# EasyEDA Pro project spark-switch.epro, board switch
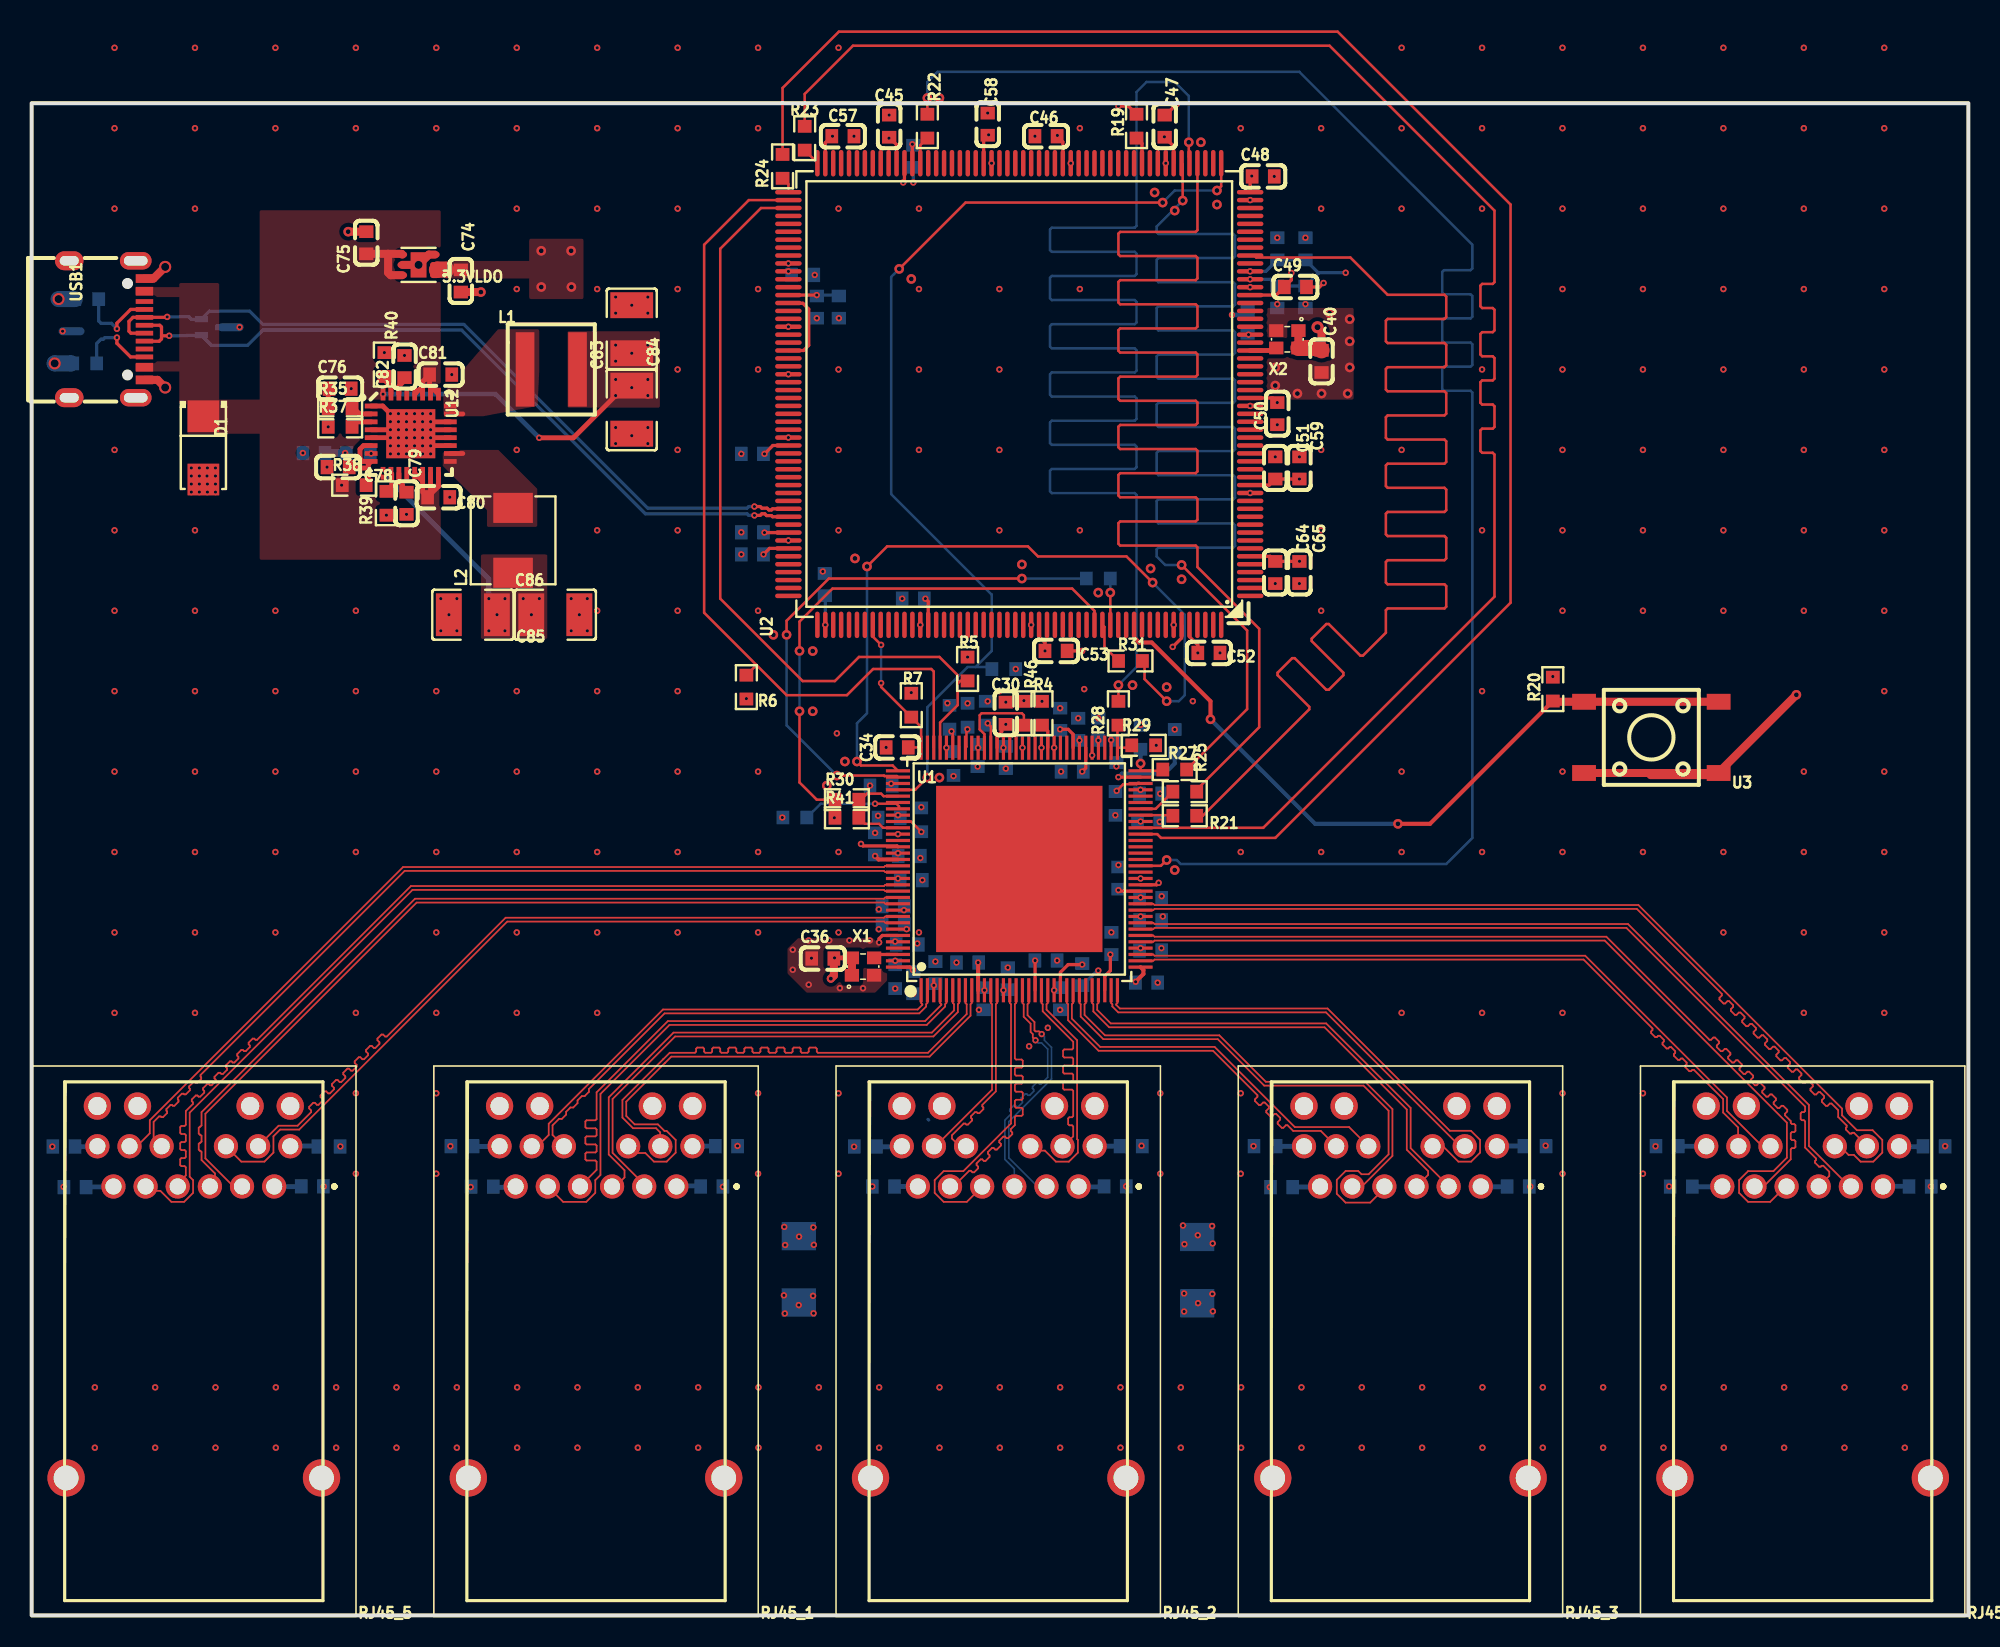
[diagram p5: board, top side]
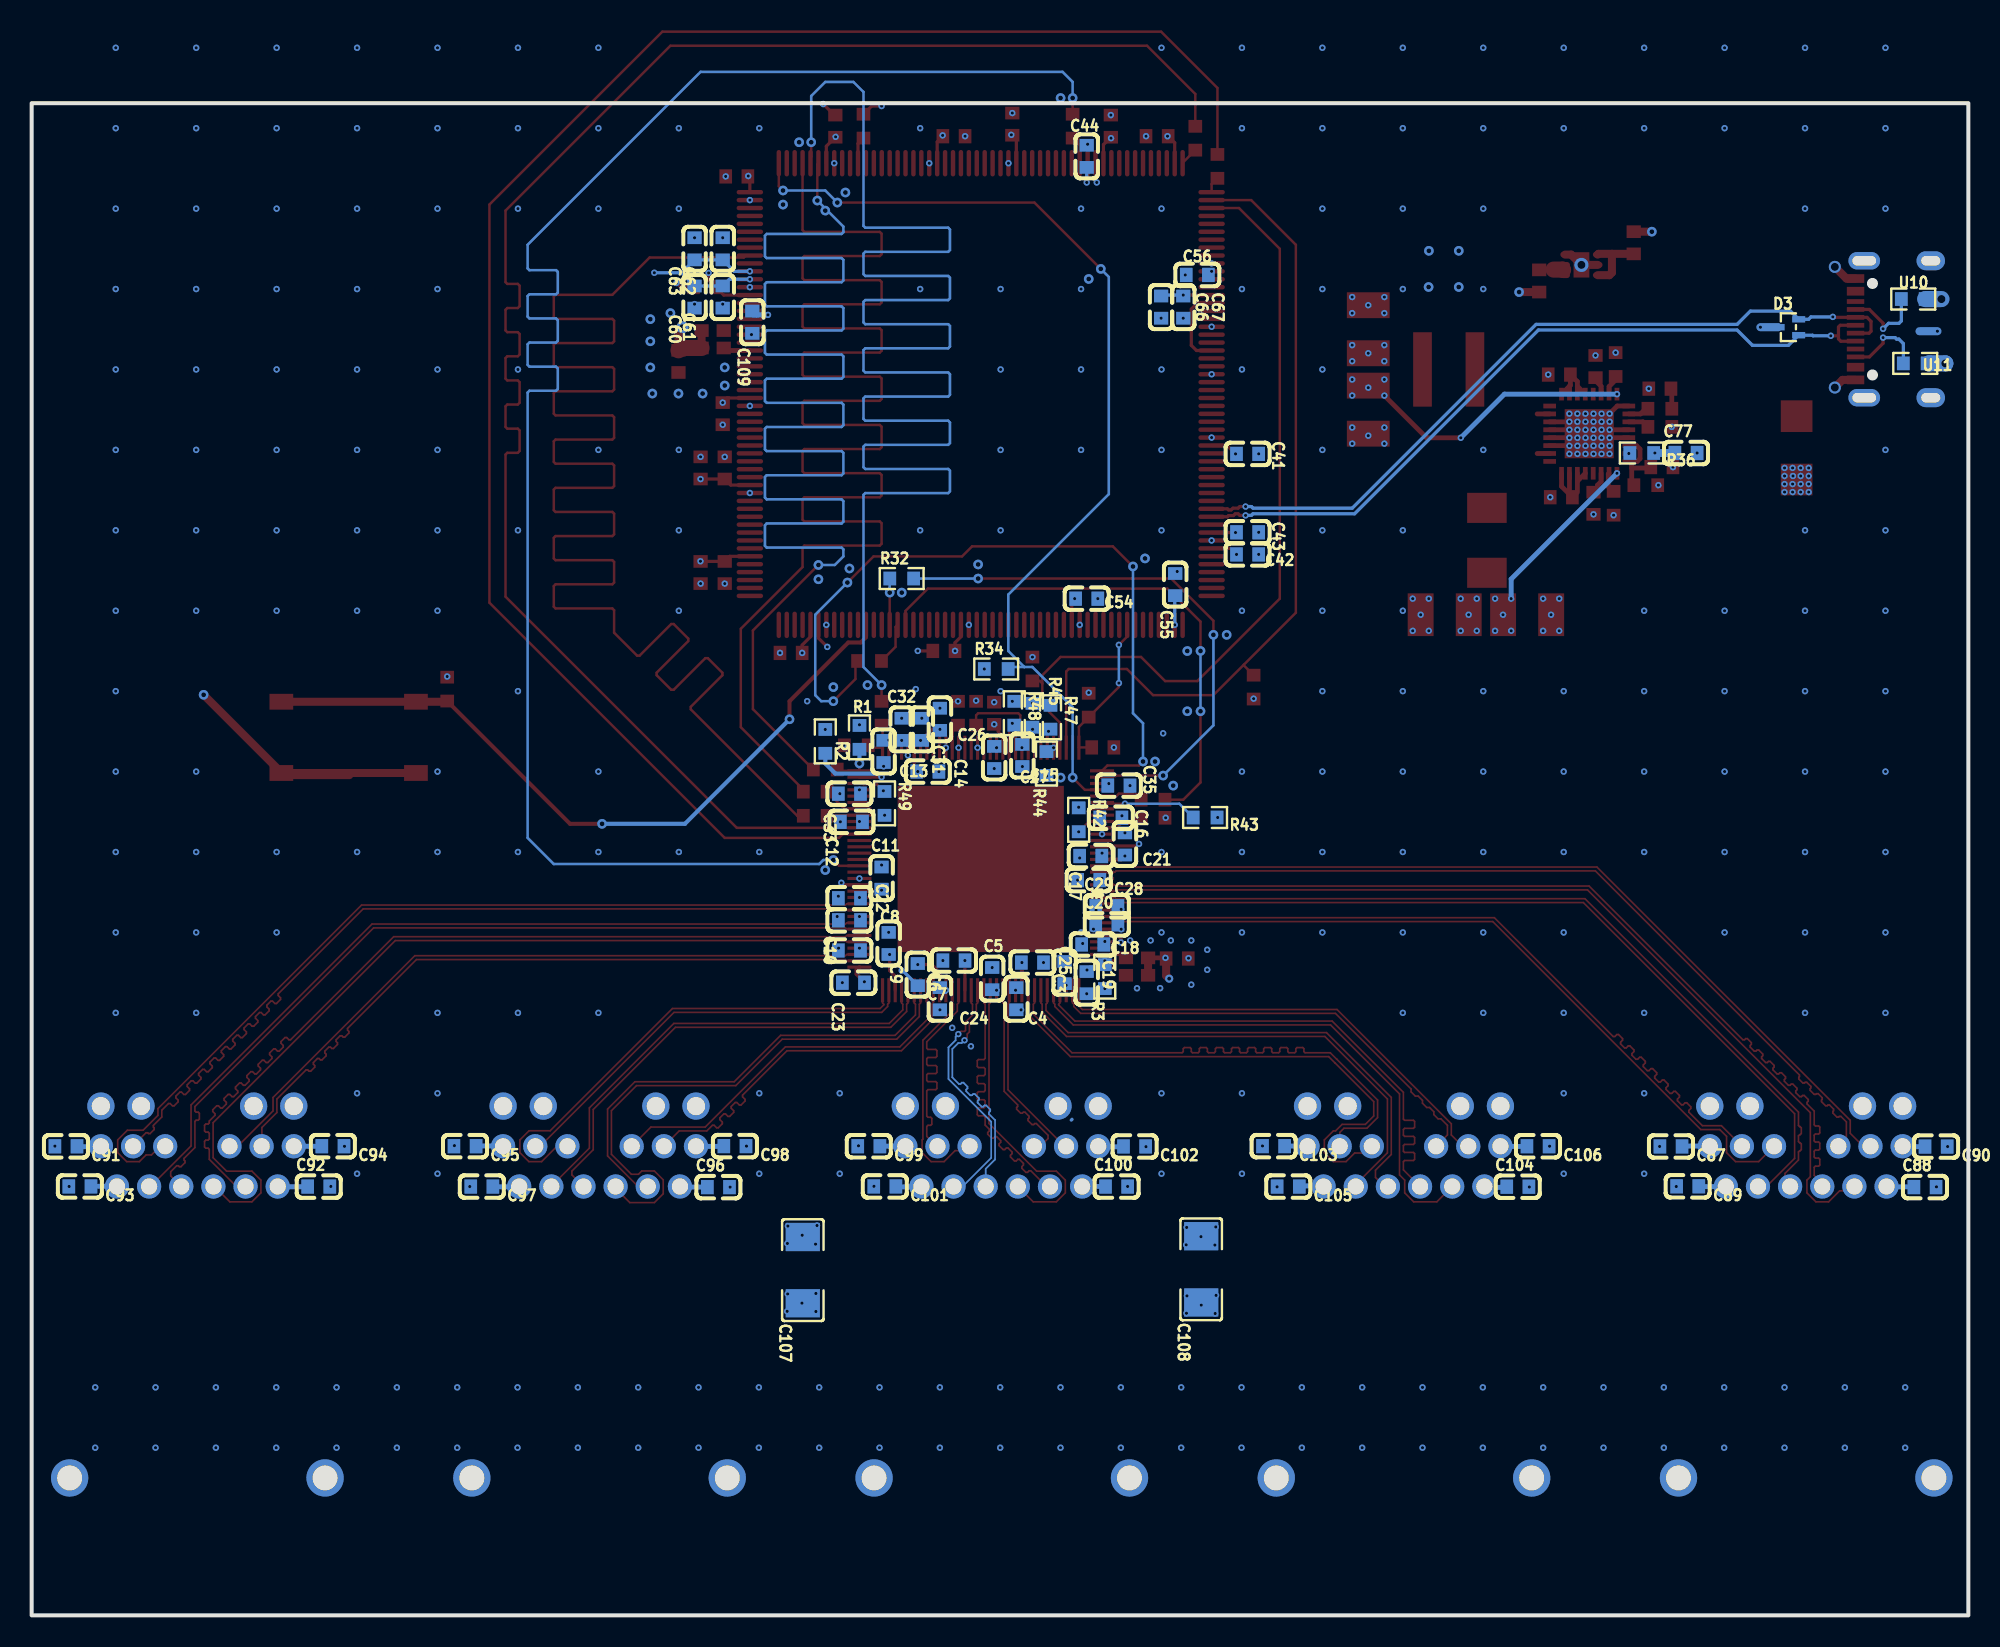
[diagram p6: board, bottom side, seen from below]

Outline 122.3 x 95.52 mm; copper layers: Top Layer, Inner1, Inner2, Inner3, Inner4, Bottom Layer. Coordinates in mm from the lower left corner of the outline.
Outline path: rectangle 0,95.52 122.3,0
Stack: Top Layer 0.035mm Outer layer thickness 1oz / Dielectric1 0.0994mm 3313 RC57% 4.2mil / Inner1 0.0152mm Inner layer thickness / Dielectric2 0.55mm 0.55mm H/H No copper / Inner2 0.0152mm Inner layer thickness / Dielectric3 0.1088mm 2116 RC54% 4.9mil / Inner3 0.0152mm Inner layer thickness / Dielectric4 0.55mm 0.55mm H/H No copper / Inner4 0.0152mm Inner layer thickness / Dielectric5 0.0994mm 3313 RC57% 4.2mil / Bottom Layer 0.035mm Outer layer thickness 1oz

## Design rules (mm)
net P2_1: Ethernet, A1
net P3_1: Ethernet, A1
net P4_1: Ethernet, B1
net P5_1: Ethernet, C1
net P6_1: Ethernet, C1
net P7_1: Ethernet, B1
net P8_1: Ethernet, D1
net P9_1: Ethernet, D1
net P2_2: Ethernet, A2
net P3_2: Ethernet, A2
net P4_2: Ethernet, B2
net P5_2: Ethernet, C2
net P6_2: Ethernet, C2
net P7_2: Ethernet, B2
net P8_2: Ethernet, D2
net P9_2: Ethernet, D2
net P2_3: Ethernet, A3
net P3_3: Ethernet, A3
net P4_3: Ethernet, B3
net P5_3: Ethernet, C3
net P6_3: Ethernet, C3
net P7_3: Ethernet, B3
net P8_3: Ethernet, D3
net P9_3: Ethernet, D3
net P2_4: Ethernet, A4
net P3_4: Ethernet, A4
net P4_4: Ethernet, B4
net P5_4: Ethernet, C4
net P6_4: Ethernet, C4
net P7_4: Ethernet, B4
net P8_4: Ethernet, D4
net P9_4: Ethernet, D4
net P2_5: Ethernet, A5
net P3_5: Ethernet, A5
net P4_5: Ethernet, B5
net P5_5: Ethernet, C5
net P6_5: Ethernet, C5
net P7_5: Ethernet, B5
net P8_5: Ethernet, D5
net P9_5: Ethernet, D5
net D+: DP2
net D-: DP2
net CC1: DP1
net CC2: DP1
template: Custom Config
spacing copperThickness1oz (default): track to track 0.102, other pairs 0.152 to 0.3
spacing copperThickness2oz: track to track 0.203, other pairs 0.152 to 0.3
spacing copperThicknessInner0.5oz: track to track 0.089, other pairs 0.152 to 0.3
spacing Ethernet: track to track 0.381, other pairs 0.152 to 0.305
spacing 50OhmSE: track to track 0.457, other pairs 0.152 to 0.3
spacing LED: track to track 0.762, other pairs 0.152 to 0.3
track width copperThickness1oz (default): min 0.102, default 0.305, max 2.54
track width copperThickness2oz: min 0.203, default 0.254, max 2.54
track width Ethernet: min 0.104, default 0.104, max 0.104
track width copperThickness0.5oz: min 0.089, default 0.254, max 2.54
track width 50OhmSE: min 0.157, default 0.157, max 0.157
track width LED: min 0.152, default 0.152, max 0.152
differential pair differentialPair (default): width min 0.127, default 0.254, max 2.54; gap min 0.152, default 0.152
differential pair Ethernet: width min 0.104, default 0.104, max 0.104; gap min 0.14, default 0.14
via viaSize (default): diameter min 0.3, default 0.406, max 10; hole min 0.2, default 0.203, max 6.3
via Ethernet: diameter min 0.4, default 0.4, max 0.4; hole min 0.2, default 0.2, max 0.2
net class Ethernet uses Ethernet
net GND uses copperRegion3
net 1.2V uses copperRegion3
net 3.3V uses copperRegion3
net P2_1 uses Ethernet
net P3_1 uses Ethernet
net P4_1 uses Ethernet
net P5_1 uses Ethernet
net P6_1 uses Ethernet
net P7_1 uses Ethernet
net P8_1 uses Ethernet
net P9_1 uses Ethernet
net P2_2 uses Ethernet
net P3_2 uses Ethernet
net P4_2 uses Ethernet
net P5_2 uses Ethernet
net P6_2 uses Ethernet
net P7_2 uses Ethernet
net P8_2 uses Ethernet
net P9_2 uses Ethernet
net P2_3 uses Ethernet
net P3_3 uses Ethernet
net P4_3 uses Ethernet
net P5_3 uses Ethernet
net P6_3 uses Ethernet
net P7_3 uses Ethernet
net P8_3 uses Ethernet
net P9_3 uses Ethernet
net P2_4 uses Ethernet
net P3_4 uses Ethernet
net P4_4 uses Ethernet
net P5_4 uses Ethernet
net P6_4 uses Ethernet
net P7_4 uses Ethernet
net P8_4 uses Ethernet
net P9_4 uses Ethernet
net P2_5 uses Ethernet
net P3_5 uses Ethernet
net P4_5 uses Ethernet
net P5_5 uses Ethernet
net P6_5 uses Ethernet
net P7_5 uses Ethernet
net P8_5 uses Ethernet
net P9_5 uses Ethernet
net 5V uses copperRegion2
net IND2.5 uses copperRegion2
net IND1.2 uses copperRegion2
diff pair A1 uses Ethernet
diff pair B1 uses Ethernet
diff pair C1 uses Ethernet
diff pair D1 uses Ethernet
diff pair A2 uses Ethernet
diff pair B2 uses Ethernet
diff pair C2 uses Ethernet
diff pair D2 uses Ethernet
diff pair A3 uses Ethernet
diff pair B3 uses Ethernet
diff pair C3 uses Ethernet
diff pair D3 uses Ethernet
diff pair A4 uses Ethernet
diff pair B4 uses Ethernet
diff pair C4 uses Ethernet
diff pair D4 uses Ethernet
diff pair A5 uses Ethernet
diff pair B5 uses Ethernet
diff pair C5 uses Ethernet
diff pair D5 uses Ethernet
pour e5324 uses copperRegion3

## Placement (name value [footprint] x y rotation side)
3.3VLDO  TLV76733DRVR  [WSON-6_L2.0-W2.0-P0.65-TL-EP]  24.43 85.3 180 top
C3  100nF  [C0603]  57.07 40.6 90 bottom
C4  100nF  [C0603]  60.12 38.95 270 bottom
C5  100nF  [C0603]  61.64 40.22 90 bottom
C6  100nF  [C0603]  64.06 41.36 0 bottom
C7  100nF  [C0603]  66.34 40.47 270 bottom
C8  100nF  [C0603]  68.18 42.44 90 bottom
C9  100nF  [C0603]  70.66 42 0 bottom
C10  100nF  [C0603]  70.66 43.9 0 bottom
C11  100nF  [C0603]  68.63 46.57 90 bottom
C12  100nF  [C0603]  70.53 50.12 0 bottom
C13  100nF  [C0603]  68.5 54.57 270 bottom
C14  100nF  [C0603]  65.71 53.3 180 bottom
C15  100nF  [C0603]  59.74 54.32 270 bottom
C16  100nF  [C0603]  54.15 50.38 180 bottom
C17  100nF  [C0603]  55.42 47.97 0 bottom
C18  100nF  [C0603]  55.29 42.38 0 bottom
C19  100nF  [C0603]  55.67 39.96 270 bottom
C20  100nF  [C0603]  54.4 43.65 180 bottom
C21  100nF  [C0603]  53.26 48.73 90 bottom
C22  100nF  [C0603]  70.66 45.3 0 bottom
C23  100nF  [C0603]  70.41 39.96 0 bottom
C24  100nF  [C0603]  64.95 38.95 270 bottom
C25  100nF  [C0603]  59.1 41.23 180 bottom
C26  100nF  [C0603]  64.95 56.6 90 bottom
C27  100nF  [C0603]  61.52 54.19 270 bottom
C28  100nF  [C0603]  55.55 46.44 0 bottom
C29  100nF  [C0603]  54.4 44.79 180 bottom
C30  100nF  [C0603]  61.52 56.98 90 top
C31  100nF  [C0603]  66.09 55.97 90 bottom
C32  100nF  [C0603]  67.36 55.97 90 bottom
C33  100nF  [C0603]  70.66 51.9 0 bottom
C34  10uF  [C0603]  54.66 54.82 180 top
C35  100nF  [C0603]  53.64 52.41 180 bottom
C36  10nF  [C0603]  49.96 41.49 0 top
C40  10nF  [C0603]  81.46 79.21 270 top
C41  100nF  [C0603]  45.51 73.37 180 bottom
C42  100nF  [C0603]  45.51 67.02 180 bottom
C43  2.2uF  [C0603]  45.51 68.41 180 bottom
C44  2.2uF  [C0603]  55.67 92.16 270 bottom
C45  100nF  [C0603]  54.15 94.07 90 top
C46  100nF  [C0603]  64.06 93.43 180 top
C47  100nF  [C0603]  71.55 94.07 90 top
C48  100nF  [C0603]  77.77 90.89 0 top
C49  100nF  [C0603]  79.8 83.91 0 top
C50  100nF  [C0603]  78.66 75.91 270 top
C51  100nF  [C0603]  78.53 72.48 90 top
C52  100nF  [C0603]  74.34 60.79 0 top
C53  100nF  [C0603]  64.69 60.92 0 top
C54  100nF  [C0603]  55.67 64.22 180 bottom
C55  100nF  [C0603]  50.09 65.11 90 bottom
C56  100nF  [C0603]  48.69 84.67 0 bottom
C57  100nF  [C0603]  51.23 93.43 0 top
C58  100nF  [C0603]  60.37 94.19 90 top
C59  4.7uF  [C0603]  80.06 72.48 90 top
C60  100nF  [C0603]  80.44 83.27 90 bottom
C61  1uF  [C0603]  78.66 83.27 90 bottom
C62  100nF  [C0603]  78.66 86.32 270 bottom
C63  1uF  [C0603]  80.44 86.32 270 bottom
C64  100nF  [C0603]  78.53 65.87 90 top
C65  1uF  [C0603]  80.06 65.87 90 top
C66  100nF  [C0603]  50.98 82.64 90 bottom
C67  1uF  [C0603]  49.58 82.64 90 bottom
C74  22uF  [C0603]  27.1 84.29 270 top
C75  1uF  [C0603]  21.13 86.7 90 top
C76  820pF  [C0603]  19.48 77.48 0 top
C77  820pF  [C0603]  17.83 73.42 180 bottom
C78  1uF  [C0603]  19.35 72.53 180 top
C79  10nF  [C0603]  23.67 70.25 270 top
C80  22uF  [C0603]  25.7 70.63 0 top
C81  22uF  [C0603]  25.83 78.37 0 top
C82  10nF  [C0603]  23.54 78.88 90 top
C83  22uF  [C1210]  37.89 81.24 90 top
C84  47uF  [C1210]  37.89 76.16 270 top
C85  100nF  [C1210]  27.86 63.21 180 top
C86  47uF  [C1210]  33.07 63.21 0 top
C87  100nF  [C0603]  18.78 29.62 0 bottom
C88  100nF  [C0603]  2.74 27.05 180 bottom
C89  100nF  [C0603]  17.72 27.1 0 bottom
C90  100nF  [C0603]  2.03 29.61 0 bottom
C91  100nF  [C0603]  120.14 29.63 0 bottom
C92  100nF  [C0603]  104.17 27.08 180 bottom
C93  100nF  [C0603]  119.26 27.09 0 bottom
C94  100nF  [C0603]  103.28 29.63 0 bottom
C95  100nF  [C0603]  94.94 29.64 0 bottom
C96  100nF  [C0603]  78.93 27.05 180 bottom
C97  100nF  [C0603]  93.87 27.09 0 bottom
C98  100nF  [C0603]  77.89 29.64 0 bottom
C99  100nF  [C0603]  69.44 29.63 0 bottom
C100  100nF  [C0603]  53.79 27.09 180 bottom
C101  100nF  [C0603]  68.42 27.09 0 bottom
C102  100nF  [C0603]  52.65 29.62 0 bottom
C103  100nF  [C0603]  43.87 29.64 0 bottom
C104  100nF  [C0603]  28.45 27.08 180 bottom
C105  100nF  [C0603]  42.95 27.09 0 bottom
C106  100nF  [C0603]  27.17 29.63 0 bottom
C107  1nF  [C1808]  73.6 21.81 90 bottom
C108  1nF  [C1808]  48.44 21.86 90 bottom
C109  100nF  [C0603]  76.79 81.68 90 bottom
D1  SMA6L5.0A  [SMA_L4.3-W2.6-LS5.2-R-RD]  10.84 73.75 270 top
D3  RCLAMP0502BATCT  [SC-75-3_L1.6-W0.8-P1.00-LS1.6-BR]  11.36 81.37 180 bottom
L1  3.3uH  [IND-SMD_L5.5-W5.3]  32.81 78.7 0 top
L2  2.2uH  [IND-SMD_L5.4-W5.2]  30.4 67.9 90 top
R1  1kΩ  [R0603]  70.03 55.46 270 bottom
R2  10kΩ  [R0603]  72.18 55.2 90 bottom
R3  6.04kΩ  [R0603]  54.53 40.35 90 bottom
R4  191Ω  [R0603]  63.8 56.98 270 top
R5  10kΩ  [R0603]  59.1 59.78 270 top
R6  10kΩ  [R0603]  45.13 58.63 90 top
R7  10kΩ  [R0603]  55.55 57.49 270 top
R19  10kΩ  [R0603]  69.77 94.07 270 top
R20  10kΩ  [R0603]  96.06 58.51 270 top
R21  33Ω  [R0603]  72.82 50.51 180 top
R22  33Ω  [R0603]  56.56 94.07 270 top
R23  33Ω  [R0603]  48.82 93.3 90 top
R24  33Ω  [R0603]  47.42 91.53 90 top
R25  33Ω  [R0603]  72.82 52.03 0 top
R27  33Ω  [R0603]  72.18 53.43 180 top
R28  33Ω  [R0603]  68.63 56.98 90 top
R29  1kΩ  [R0603]  70.22 54.96 0 top
R30  33Ω  [R0603]  51.48 51.52 0 top
R31  33Ω  [R0603]  69.39 60.28 0 top
R32  33Ω  [R0603]  67.36 65.49 180 bottom
R34  10kΩ  [R0603]  61.39 59.78 180 bottom
R35  30kΩ  [R0603]  19.48 76.22 0 top
R36  30kΩ  [R0603]  20.62 73.42 0 bottom
R37  8.2kΩ  [R0603]  19.48 75.07 0 top
R38  10Ω  [R0603]  20.37 71.39 0 top
R39  4.7kΩ  [R0603]  22.4 70.25 90 top
R40  27kΩ  [R0603]  22.27 79.01 270 top
R41  10kΩ  [R0603]  51.48 50.38 0 top
R42  10kΩ  [R0603]  56.18 50.25 270 bottom
R43  10kΩ  [R0603]  48.2 50.4 0 bottom
R44  10kΩ  [R0603]  58.21 53.81 90 bottom
R45  10kΩ  [R0603]  59.1 56.86 270 bottom
R46  10kΩ  [R0603]  62.66 56.98 270 top
R47  10kΩ  [R0603]  57.96 56.73 270 bottom
R48  10kΩ  [R0603]  60.25 56.98 270 bottom
R49  10kΩ  [R0603]  68.44 51.29 270 bottom
RJ45_1  0826-1G1T-23-F  [08261G1T23F]  40.71 27.09 180 top
RJ45_2  0826-1G1T-23-F  [08261G1T23F]  66.11 27.09 180 top
RJ45_3  0826-1G1T-23-F  [08261G1T23F]  91.51 27.09 180 top
RJ45_4  0826-1G1T-23-F  [08261G1T23F]  116.91 27.09 180 top
RJ45_5  0826-1G1T-23-F  [08261G1T23F]  15.31 27.09 180 top
U1  KSZ9477STXI-TR  [TQFP-128_L14.0-W14.0-P0.40-LS16.0-BL-EP]  62.37 47.15 0 top
U2  STM32F469BET6  [LQFP-208_L28.0-W28.0-P0.50-LS30.0-BL]  62.37 77.15 90 top
U3  TS6643TP 250gf 009  [SW-SMD_4P-L6.2-W6.0-P4.50-LS9.0]  102.28 55.46 180 top
U10  5.1kΩ  [R0603]  3.48 83.14 180 bottom
U11  5.1kΩ  [R0603]  3.35 79.08 180 bottom
U12  ADP2116ACPZ-R7  [LFCSP-32_L5.0-W5.0-P0.50-BL-EP3.1]  23.94 74.64 270 top
USB1  TYPE-C 16PIN 2MD(073)  [USB-C-SMD_TYPE-C-6PIN-2MD-073]  4.75 81.24 270 top
X1  25MHz  [OSC-SMD_4P-L2.0-W1.6-BL_8NE]  52.5 40.98 0 top
X2  25MHz  [OSC-SMD_4P-L2.0-W1.6-BL_8NE]  79.3 80.6 180 top

## Footprints (pads in the part's own frame, mm; a bottom-side part is the same pattern mirrored in y, then rotated)
08261G1T23F
  round 1.53 hole 1.02: 1(0,0) 2(2.03,0) 3(4.06,0) 4(6.09,0) 5(8.12,0) 6(10.15,0) 7(-1.015,-2.54) 8(1.015,-2.54) 9(3.045,-2.54) 10(7.105,-2.54) 11(9.135,-2.54) 12(11.165,-2.54)
  round 1.725 hole 1.15: 13(-1.015,-5.08) 14(1.52,-5.08) 15(8.63,-5.08) 16(11.165,-5.08)
  round 2.355 hole 1.57: 19(-2.99,18.41) 20(13.14,18.41)
C0603
  rect 0.8x0.9 smd: 1(-0.7,0) 2(0.7,0)
C1210
  rect 1.635x2.7 smd: 1(-1.518,0) 2(1.518,0)
C1808
  rect 1.785x2.16 smd: 1(-2.092,0) 2(2.092,0)
IND-SMD_L5.4-W5.2
  rect 1.9x2.5 smd: 1(2.05,0) 2(-2.05,0)
IND-SMD_L5.5-W5.3
  rect 1.18x4.7 smd: 1(-1.655,0) 2(1.655,0)
LFCSP-32_L5.0-W5.0-P0.50-BL-EP3.1
  rect 0.3x0.8 smd: 1(-1.75,-2.5) 2(-1.25,-2.5) 3(-0.75,-2.5) 4(-0.25,-2.5) 5(0.25,-2.5) 6(0.75,-2.5) 7(1.25,-2.5) 8(1.75,-2.5) 17(1.75,2.5) 18(1.25,2.5) 19(0.75,2.5) 20(0.25,2.5) 21(-0.25,2.5) 22(-0.75,2.5) 23(-1.25,2.5) 24(-1.75,2.5)
  rect 0.8x0.299 smd: 9(2.5,-1.75) 10(2.5,-1.25) 11(2.5,-0.75) 12(2.5,-0.25) 13(2.5,0.25) 14(2.5,0.75) 15(2.5,1.25) 16(2.5,1.75) 25(-2.5,1.75) 26(-2.5,1.25) 27(-2.5,0.75) 28(-2.5,0.25) 29(-2.5,-0.25) 30(-2.5,-0.75) 31(-2.5,-1.25) 32(-2.5,-1.75)
  rect 3.1x3.1 smd: 33(0,0)
LQFP-208_L28.0-W28.0-P0.50-LS30.0-BL
  oval 0.28x1.67 smd: 1(-12.75,-14.58) 2(-12.25,-14.58) 3(-11.75,-14.58) 4(-11.25,-14.58) 5(-10.75,-14.58) 6(-10.25,-14.58) 7(-9.75,-14.58) 8(-9.25,-14.58) 9(-8.75,-14.58) 10(-8.25,-14.58) 11(-7.75,-14.58) 12(-7.25,-14.58) 13(-6.75,-14.58) 14(-6.25,-14.58) 15(-5.75,-14.58) 16(-5.25,-14.58) 17(-4.75,-14.58) 18(-4.25,-14.58) 19(-3.75,-14.58) 20(-3.25,-14.58) 21(-2.75,-14.58) 22(-2.25,-14.58) 23(-1.75,-14.58) 24(-1.25,-14.58) 25(-0.75,-14.58) 26(-0.25,-14.58) 27(0.25,-14.58) 28(0.75,-14.58) 29(1.25,-14.58) 30(1.75,-14.58) 31(2.25,-14.58) 32(2.75,-14.58) 33(3.25,-14.58) 34(3.75,-14.58) 35(4.25,-14.58) 36(4.75,-14.58) 37(5.25,-14.58) 38(5.75,-14.58) 39(6.25,-14.58) 40(6.75,-14.58) 41(7.25,-14.58) 42(7.75,-14.58) 43(8.25,-14.58) 44(8.75,-14.58) 45(9.25,-14.58) 46(9.75,-14.58) 47(10.25,-14.58) 48(10.75,-14.58) 49(11.25,-14.58) 50(11.75,-14.58) 51(12.25,-14.58) 52(12.75,-14.58) 105(12.75,14.58) 106(12.25,14.58) 107(11.75,14.58) 108(11.25,14.58) 109(10.75,14.58) 110(10.25,14.58) 111(9.75,14.58) 112(9.25,14.58) 113(8.75,14.58) 114(8.25,14.58) 115(7.75,14.58) 116(7.25,14.58) 117(6.75,14.58) 118(6.25,14.58) 119(5.75,14.58) 120(5.25,14.58) 121(4.75,14.58) 122(4.25,14.58) 123(3.75,14.58) 124(3.25,14.58) 125(2.75,14.58) 126(2.25,14.58) 127(1.75,14.58) 128(1.25,14.58) 129(0.75,14.58) 130(0.25,14.58) 131(-0.25,14.58) 132(-0.75,14.58) 133(-1.25,14.58) 134(-1.75,14.58) 135(-2.25,14.58) 136(-2.75,14.58) 137(-3.25,14.58) 138(-3.75,14.58) 139(-4.25,14.58) 140(-4.75,14.58) 141(-5.25,14.58) 142(-5.75,14.58) 143(-6.25,14.58) 144(-6.75,14.58) 145(-7.25,14.58) 146(-7.75,14.58) 147(-8.25,14.58) 148(-8.75,14.58) 149(-9.25,14.58) 150(-9.75,14.58) 151(-10.25,14.58) 152(-10.75,14.58) 153(-11.25,14.58) 154(-11.75,14.58) 155(-12.25,14.58) 156(-12.75,14.58)
  oval 1.67x0.28 smd: 53(14.58,-12.75) 54(14.58,-12.25) 55(14.58,-11.75) 56(14.58,-11.25) 57(14.58,-10.75) 58(14.58,-10.25) 59(14.58,-9.75) 60(14.58,-9.25) 61(14.58,-8.75) 62(14.58,-8.25) 63(14.58,-7.75) 64(14.58,-7.25) 65(14.58,-6.75) 66(14.58,-6.25) 67(14.58,-5.75) 68(14.58,-5.25) 69(14.58,-4.75) 70(14.58,-4.25) 71(14.58,-3.75) 72(14.58,-3.25) 73(14.58,-2.75) 74(14.58,-2.25) 75(14.58,-1.75) 76(14.58,-1.25) 77(14.58,-0.75) 78(14.58,-0.25) 79(14.58,0.25) 80(14.58,0.75) 81(14.58,1.25) 82(14.58,1.75) 83(14.58,2.25) 84(14.58,2.75) 85(14.58,3.25) 86(14.58,3.75) 87(14.58,4.25) 88(14.58,4.75) 89(14.58,5.25) 90(14.58,5.75) 91(14.58,6.25) 92(14.58,6.75) 93(14.58,7.25) 94(14.58,7.75) 95(14.58,8.25) 96(14.58,8.75) 97(14.58,9.25) 98(14.58,9.75) 99(14.58,10.25) 100(14.58,10.75) 101(14.58,11.25) 102(14.58,11.75) 103(14.58,12.25) 104(14.58,12.75) 157(-14.58,12.75) 158(-14.58,12.25) 159(-14.58,11.75) 160(-14.58,11.25) 161(-14.58,10.75) 162(-14.58,10.25) 163(-14.58,9.75) 164(-14.58,9.25) 165(-14.58,8.75) 166(-14.58,8.25) 167(-14.58,7.75) 168(-14.58,7.25) 169(-14.58,6.75) 170(-14.58,6.25) 171(-14.58,5.75) 172(-14.58,5.25) 173(-14.58,4.75) 174(-14.58,4.25) 175(-14.58,3.75) 176(-14.58,3.25) 177(-14.58,2.75) 178(-14.58,2.25) 179(-14.58,1.75) 180(-14.58,1.25) 181(-14.58,0.75) 182(-14.58,0.25) 183(-14.58,-0.25) 184(-14.58,-0.75) 185(-14.58,-1.25) 186(-14.58,-1.75) 187(-14.58,-2.25) 188(-14.58,-2.75) 189(-14.58,-3.25) 190(-14.58,-3.75) 191(-14.58,-4.25) 192(-14.58,-4.75) 193(-14.58,-5.25) 194(-14.58,-5.75) 195(-14.58,-6.25) 196(-14.58,-6.75) 197(-14.58,-7.25) 198(-14.58,-7.75) 199(-14.58,-8.25) 200(-14.58,-8.75) 201(-14.58,-9.25) 202(-14.58,-9.75) 203(-14.58,-10.25) 204(-14.58,-10.75) 205(-14.58,-11.25) 206(-14.58,-11.75) 207(-14.58,-12.25) 208(-14.58,-12.75)
OSC-SMD_4P-L2.0-W1.6-BL_8NE
  rect 0.9x0.8 smd: 1(-0.7,-0.55) 2(0.7,-0.55) 3(0.7,0.55) 4(-0.7,0.55)
R0603
  rect 0.806x0.864 smd: 1(-0.753,0) 2(0.753,0)
SC-75-3_L1.6-W0.8-P1.00-LS1.6-BR
  rect 0.816x0.4 smd: 1(0.65,-0.5) 2(0.65,0.5) 3(-0.65,0)
SMA_L4.3-W2.6-LS5.2-R-RD
  rect 2x2 smd: 1(2.001,0) 2(-2.001,0)
SW-SMD_4P-L6.2-W6.0-P4.50-LS9.0
  rect 1.5x1 smd: 1(-4.25,2.25) 2(4.25,2.25) 3(-4.25,-2.25) 4(4.25,-2.25)
TQFP-128_L14.0-W14.0-P0.40-LS16.0-BL-EP
  rect 0.2x1.52 smd: 1(-6.2,-7.66) 2(-5.8,-7.66) 3(-5.4,-7.66) 4(-5,-7.66) 5(-4.6,-7.66) 6(-4.2,-7.66) 7(-3.8,-7.66) 8(-3.4,-7.66) 9(-3,-7.66) 10(-2.6,-7.66) 11(-2.2,-7.66) 12(-1.8,-7.66) 13(-1.4,-7.66) 14(-1,-7.66) 15(-0.6,-7.66) 16(-0.2,-7.66) 17(0.2,-7.66) 18(0.6,-7.66) 19(1,-7.66) 20(1.4,-7.66) 21(1.8,-7.66) 22(2.2,-7.66) 23(2.6,-7.66) 24(3,-7.66) 25(3.4,-7.66) 26(3.8,-7.66) 27(4.2,-7.66) 28(4.6,-7.66) 29(5,-7.66) 30(5.4,-7.66) 31(5.8,-7.66) 32(6.2,-7.66) 65(6.2,7.66) 66(5.8,7.66) 67(5.4,7.66) 68(5,7.66) 69(4.6,7.66) 70(4.2,7.66) 71(3.8,7.66) 72(3.4,7.66) 73(3,7.66) 74(2.6,7.66) 75(2.2,7.66) 76(1.8,7.66) 77(1.4,7.66) 78(1,7.66) 79(0.6,7.66) 80(0.2,7.66) 81(-0.2,7.66) 82(-0.6,7.66) 83(-1,7.66) 84(-1.4,7.66) 85(-1.8,7.66) 86(-2.2,7.66) 87(-2.6,7.66) 88(-3,7.66) 89(-3.4,7.66) 90(-3.8,7.66) 91(-4.2,7.66) 92(-4.6,7.66) 93(-5,7.66) 94(-5.4,7.66) 95(-5.8,7.66) 96(-6.2,7.66)
  rect 1.52x0.2 smd: 33(7.66,-6.2) 34(7.66,-5.8) 35(7.66,-5.4) 36(7.66,-5) 37(7.66,-4.6) 38(7.66,-4.2) 39(7.66,-3.8) 40(7.66,-3.4) 41(7.66,-3) 42(7.66,-2.6) 43(7.66,-2.2) 44(7.66,-1.8) 45(7.66,-1.4) 46(7.66,-1) 47(7.66,-0.6) 48(7.66,-0.2) 49(7.66,0.2) 50(7.66,0.6) 51(7.66,1) 52(7.66,1.4) 53(7.66,1.8) 54(7.66,2.2) 55(7.66,2.6) 56(7.66,3) 57(7.66,3.4) 58(7.66,3.8) 59(7.66,4.2) 60(7.66,4.6) 61(7.66,5) 62(7.66,5.4) 63(7.66,5.8) 64(7.66,6.2) 97(-7.66,6.2) 98(-7.66,5.8) 99(-7.66,5.4) 100(-7.66,5) 101(-7.66,4.6) 102(-7.66,4.2) 103(-7.66,3.8) 104(-7.66,3.4) 105(-7.66,3) 106(-7.66,2.6) 107(-7.66,2.2) 108(-7.66,1.8) 109(-7.66,1.4) 110(-7.66,1) 111(-7.66,0.6) 112(-7.66,0.2) 113(-7.66,-0.2) 114(-7.66,-0.6) 115(-7.66,-1) 116(-7.66,-1.4) 117(-7.66,-1.8) 118(-7.66,-2.2) 119(-7.66,-2.6) 120(-7.66,-3) 121(-7.66,-3.4) 122(-7.66,-3.8) 123(-7.66,-4.2) 124(-7.66,-4.6) 125(-7.66,-5) 126(-7.66,-5.4) 127(-7.66,-5.8) 128(-7.66,-6.2)
  rect 10.5x10.5 smd: 129(0,0)
USB-C-SMD_TYPE-C-6PIN-2MD-073
  rect 0.55x1.1 smd: 1(-3.2,2.375) 2(-2.4,2.375) 11(2.4,2.375) 12(3.2,2.375)
  rect 0.3x1.1 smd: 3(-1.75,2.375) 4(-1.25,2.375) 5(-0.75,2.375) 6(-0.25,2.375) 7(0.25,2.375) 8(0.75,2.375) 9(1.25,2.375) 10(1.75,2.375)
  oval 1.1x2 hole 0.6x1.5: 13(-4.325,1.825) 14(4.325,1.825)
  oval 1.2x1.8 hole 0.6x1.2: 13(-4.325,-2.375) 14(4.325,-2.375)
WSON-6_L2.0-W2.0-P0.65-TL-EP
  oval 0.607x0.364 smd: 1(-1.028,0.65) 2(-1.028,0) 3(-1.028,-0.65) 4(1.028,-0.65) 5(1.028,0) 6(1.028,0.65)
  rect 1x1.6 smd: 7(0,0)

## Nets
As in the schematic.

Pads without a net: RJ45_1 13 14 15 16; RJ45_2 13 14 15 16; RJ45_3 13 14 15 16; RJ45_4 13 14 15 16; RJ45_5 13 14 15 16; U1 48 50 51 52 53 59 60 67 73 74 78 79 81 82 88 90 95 102 108 125; U2 1 2 3 4 5 7 8 9 10 11 12 13 16 17 18 19 20 21 22 23 24 27 28 29 30 31 33 35 36 37 38 43 45 46 47 48 49 50 54 55 61 62 64 65 66 67 68 69 70 71 74 75 76 77 78 79 80 81 84 85 86 87 88 89 90 95 96 97 98 99 100 101 102 108 109 110 111 112 113 116 117 120 121 123 124 126 127 129 130 131 132 133 134 135 138 139 140 141 142 143 144 147 151 152 153 154 155 156 157 159 160 161 162 163 165 166 167 168 169 172 173 174 175 176 177 178 179 180 181 182 183 186 187 188 189 190 191 195 196 198 199 200 201 205 206 207 208; U12 12 29; USB1 3 9

## Via types
v1: diameter 0.406, hole 0.203, Top Layer to Bottom Layer, 605 vias
v2: diameter 0.61, hole 0.305, Top Layer to Bottom Layer, 59 vias
v3: diameter 0.762, hole 0.508, Top Layer to Bottom Layer, 4 vias
v4: diameter 0.889, hole 0.508, Top Layer to Bottom Layer, 1 via
v5: diameter 0.508, hole 0.254, Top Layer to Bottom Layer, 1 via
v6: diameter 0.4, hole 0.2, Top Layer to Bottom Layer, 2 vias
v7: diameter 0.762, hole 0.381, Top Layer to Bottom Layer, 1 via

## Routing (per net, layer and track width the routed paths; a pad name or vN(x,y) marks a point on that pad's centre or on a via; arc(x,y) is an arc through that point)
1V2: length 20.8
  Top Layer w0.203: v1(68.12,41.74) 68.12,40.73 67.77,40.37 U1.30 ; v1(66.34,41.11) 65.45,41.11 64.97,40.62 U1.23 ; U1.70 66.57,53.52 v1(66.34,53.3) ; U1.45 68.69,45.75 v1(68.63,45.81) ; U1.19 v1(63.37,41.36)
  Bottom Layer w0.254: v1(66.34,53.3) 66.41,53.3 ; v1(63.37,41.36) C6.1 ; v1(68.12,41.74) C8.1
  Bottom Layer w0.305: v1(28.87,64.22) 28.87,65.46 v1(22.19,72.14)
  vias: v1(28.87,62.19) v1(29.39,63.21) v1(29.89,64.22) v1(29.89,62.19) v1(31.04,64.22) v1(31.04,62.19) v1(31.56,63.21) v1(32.06,64.22) v1(32.06,62.19) v1(54.53,42.57) v1(54.71,50.55) v1(54.71,48.15) v1(54.71,46.55) v1(55.08,44.55) v1(56.97,39.8) v1(59.77,54.81) v1(60.17,39.49) v1(61.37,39.49) v1(68.17,55.29) v1(70.03,50.15) v1(70.03,44.15) v1(70.03,42.15)
2V5: length 16.9
  Top Layer w0.305: v1(36.88,77.05) 34.21,74.38 v1(32.05,74.38)
  Bottom Layer w0.305: v1(32.05,74.38) 29.3,77.14 v1(22.19,77.14)
  vias: v1(36.88,80.24) v1(36.88,79.22) v1(36.88,78.06) v1(37.89,79.72) v1(37.89,77.55) v1(38.91,80.24) v1(38.91,79.22) v1(38.91,78.06) v1(38.91,77.05) v1(49.24,41.51)
3.3V: length 19.8
  Top Layer w0.508: 106.5,53.21 v2(111.44,58.15) ; 106.5,53.21 106.37,53.07 102.24,53.07 ; 106.5,53.21 U3.2 ; 106.5,53.21 U3.1
  vias: v2(32.18,86.19) v2(32.18,83.91) v2(34.07,86.19) v2(34.08,83.91)
3V3: length 119.9
  Top Layer w0.158: v1(53.64,61.3) 53.12,61.83 53.12,62.57 ; 45.75,60.05 45.75,60 R6.2 ; 45.75,60.05 47.67,58.13 51.48,58.13 53.13,59.78 56.81,59.78 56.97,59.62 56.97,54.81 ; 45.75,60.05 42.47,63.33 42.47,86.57 45.29,89.4 47.79,89.4 ; v1(53.64,58.89) 53.64,58.64 R7.2 56.17,56.12 56.17,54.81 56.15,54.82 55.36,54.82
  Top Layer w0.203: v1(78.66,76.61) 78.37,76.9 U2.26 ; U2.92 v1(55.62,92.92) ; v1(56.44,64.22) 56.62,64.04 U2.171 ; C47.1 72.12,92.8 U2.59 ; v1(80.07,66.58) C65.2 C64.2 78.21,66.9 U2.6 ; v1(73.64,60.79) 73.64,61.29 73.12,61.81 U2.204 ; U2.83 60.12,93.24 C58.1 ; v1(79.55,84.8) 79.55,84.35 C49.1 78.59,83.4 U2.39 ; U2.148 v1(46.28,68.4) ; C46.1 65.12,93.07 U2.73 ; v1(63.99,60.92) 63.99,61.44 63.62,61.81 U2.185 ; v1(46.28,73.37) 46.81,73.9 U2.137 ; U2.52 76.95,90.77 C48.1 ; U2.94 54.62,92.9 C45.1 ; U2.15 78.15,71.4 C51.1 v1(80.06,71.78) ; U2.203 72.62,61.73 v1(72.06,61.17) ; U2.150 46.59,67.4 v1(46.21,67.02) ; U2.118 v1(49.58,83.4) ; U2.103 50.12,93.02 50.53,93.43
  Top Layer w0.508: C40.1 81.46,81.11 v7(81.2,81.37) ; X2.4 80,81.15
  Top Layer w1.016: 26.19,85.01 25.62,85.01 25.59,84.98 ; C40.1 81.31,80.05 X2.4
  Bottom Layer w0.158: v1(53.64,58.89) v1(53.64,61.3)
  Bottom Layer w0.203: C44.1 55.67,92.87 v1(55.62,92.92) ; v1(50.12,62.57) 50.12,64.38 C55.1 ; v1(46.28,68.4) 46.23,68.4 C43.1 ; v1(82.98,84.81) 81.29,84.81 81.27,84.79 ; C67.2 v1(49.58,83.4) 50.92,83.4 C66.2 ; 81.27,84.79 80.44,85.62 78.66,85.62 77.94,84.9 v1(76.95,84.9) ; 81.27,84.79 81.26,84.79 C60.2 C61.2 78.24,84.4 v1(76.95,84.4) ; v1(56.44,64.22) C54.1 ; v1(46.28,73.37) C41.1
  vias: v1(47.4,50.4) v1(47.79,84.9) v1(50.57,93.43) v1(50.69,50.38) v1(54.14,93.31) v1(57.83,57.62) v1(59.1,60.53) v1(59.1,57.61) v1(60.37,57.74) v1(60.43,93.52) v1(62.14,59.78) v1(62.66,57.78) v1(64.77,93.48) v1(71.53,93.39) v1(77.05,90.92)
5V: length 13.6
  Top Layer w0.305: U12.26 25.19,77.64 ; 25.19,77.64 25.13,77.7 C81.1 24.69,77.93 24.69,77.64 ; 25.19,77.64 U12.25 ; U12.28 24.69,77.64 ; 24.69,77.64 U12.27 ; U12.14 24.69,71.64 ; 24.69,71.64 24.69,70.94 ; 24.69,71.64 U12.13 ; U12.15 25.19,70.81 ; 25.19,70.81 C80.1 ; 25.19,70.81 25.69,71.31 U12.16
  Top Layer w0.508: 22.51,86 22.51,84.82 22.67,84.65 3.3VLDO.6 ; 22.51,86 23.36,86 23.4,85.95 ; 22.51,86 C75.1
  vias: v1(19.57,71.39)
GND: length 39.1
  Top Layer w0.203: C49.2 81.33,83.91 v1(81.58,84.16) ; v1(68.63,95.34) 69.25,95.34 R19.1 ; U1.46 71.04,46.15 v1(71.17,46.27) ; v1(52.37,48.73) 52.5,48.6 54.65,48.6 U1.109 ; U2.93 55.12,90.59 v1(55.04,90.51) ; 65.39,60.92 v1(66.34,60.92) ; C47.2 71.61,94.77 v1(72.31,95.46) ; U1.123 53.72,42.95 53.52,42.74 v1(53.52,42.5)
  Top Layer w0.305: v1(25.19,75.4) 25.2,75.39 U12.22 ; U12.5 22.65,74.39 v1(22.65,74.38) ; U12.20 25.2,74.39 v1(25.19,74.38) ; 50.66,41.49 v1(50.7,41.53) 51.8,41.53 ; v1(22.65,75.91) 22.17,76.39 U12.1 ; U12.21 v1(25.19,74.89) ; v1(25.19,73.87) 25.21,73.89 U12.19 ; U12.4 v1(22.65,74.89)
  Top Layer w0.508: 25.46,85.95 25.08,85.95 v4(24.43,85.3) 3.3VLDO.5 ; 51.8,41.53 51.8,40.43 ; 50.66,41.49 50.66,40.41 v5(50.47,40.22) ; USB1.1 7.69,84.44 v3(8.43,85.18) ; 7.12,78.04 7.95,78.04 v3(8.43,77.56) ; C74.2 v2(28.37,83.59) ; C75.2 v2(19.99,87.4)
  Bottom Layer w0.203: C44.2 v1(55.67,90.51) ; v1(67.36,40.73) 67.3,40.73 C7.2
  Bottom Layer w0.305: v1(75.8,82.15) 76.51,82.15 76.52,82.15 76.78,82.15 76.78,82.4 76.75,82.43
  Bottom Layer w0.508: D3.3 v1(13.13,81.37) ; 3.08,81.11 v1(1.95,81.11)
  Bottom Layer w1.016: v3(1.45,79.08) 1.46,79.08 2.47,79.08 2.48,79.08 ; U10.2 v3(1.7,83.14)
  vias: v1(1.31,29.61) v1(2.01,27.07) v1(5.23,99.02) v1(5.23,93.94) v1(5.23,88.86) v1(5.23,73.62) v1(5.23,68.54) v1(5.23,63.46) v1(5.23,58.38) v1(5.23,53.3) v1(5.23,48.22) v1(5.23,43.14) v1(5.23,38.06) v1(10.08,72.48) v1(10.08,71.97) v1(10.08,71.46) v1(10.08,70.95) v1(10.31,99.02) v1(10.31,93.94) v1(10.31,88.86) v1(10.31,68.54) v1(10.31,63.46) v1(10.31,58.38) v1(10.31,53.3) v1(10.31,48.22) v1(10.31,43.14) v1(10.31,38.06) v1(10.59,72.48) v1(10.59,71.97) v1(10.59,71.46) v1(10.59,70.95) v1(11.1,72.48) v1(11.07,71.97) v1(11.1,71.46) v1(11.1,70.95) v1(11.61,72.48) v1(11.61,71.97) v1(11.61,71.46) v1(11.61,70.95) v1(15.39,99.02) v1(15.39,93.94) v1(15.39,63.46) v1(15.39,58.38) v1(15.39,53.3) v1(15.39,48.22) v1(15.39,43.14) v1(17.13,73.42) v1(18.44,27.09) v1(18.65,72.53) v1(18.73,75.07) v1(19.5,29.62) v1(20.18,77.48) v1(20.47,99.02) v1(20.47,93.94) v1(20.47,63.46) v1(20.47,58.38) v1(20.47,53.3) v1(20.47,48.22) v1(20.47,38.06) v1(20.47,32.98) v1(20.47,27.9) v1(22.27,79.76) v1(22.4,69.49) v1(22.65,75.4) v1(22.65,73.87) v1(22.65,73.37) v1(23.16,75.91) v1(23.16,75.4) v1(23.16,74.89) v1(23.16,74.38) v1(23.16,73.87) v1(23.16,73.37) v1(23.54,79.58) v1(23.67,75.91) v1(23.67,75.4) v1(23.67,74.89) v1(23.67,74.38) v1(23.67,73.87) v1(23.67,73.37) v1(23.67,69.55) v1(24.18,75.91) v1(24.18,75.4) v1(24.18,74.89) v1(24.18,74.38) v1(24.18,73.87) v1(24.18,73.37) v1(24.69,75.91) v1(24.69,75.4) v1(24.69,74.89) v1(24.69,74.38) v1(24.69,73.87) v1(24.69,73.37) v1(25.19,75.91) v1(25.19,73.37) v1(25.55,99.02) v1(25.55,93.94) v1(25.55,58.38) v1(25.55,53.3) v1(25.55,48.22) v1(25.55,43.14) v1(25.55,38.06) v1(25.55,32.98) v1(25.55,27.9) v1(25.84,64.22) v1(25.84,62.19) v1(26.35,63.21) v1(26.4,70.63) v1(26.44,29.63) v1(26.53,78.37) v1(26.85,64.22) v1(26.85,62.19) v1(27.72,27.06) v1(30.63,99.02) v1(30.63,93.94) v1(30.63,88.86) v1(30.63,83.78) v1(30.63,73.62) v1(30.63,58.38) v1(30.63,53.3) v1(30.63,48.22) v1(30.63,43.14) v1(30.63,38.06) v1(34.07,64.22) v1(34.07,62.19) v1(34.59,63.21) v1(35.09,64.22) v1(35.09,62.19) v1(35.71,99.02) v1(35.71,93.94) v1(35.71,88.86) v1(35.71,83.78) v1(35.71,68.54) v1(35.71,63.46) v1(35.71,58.38) v1(35.71,53.3) v1(35.71,48.22) v1(35.71,43.14) v1(35.71,38.06) v1(36.88,83.27) v1(36.88,82.26) v1(36.88,75.03) v1(36.88,74.01) v1(37.89,82.76) v1(37.89,74.52) v1(38.91,83.27) v1(38.91,82.26) v1(38.91,75.03) v1(38.91,74.01) v1(40.79,99.02) v1(40.79,93.94) v1(40.79,88.86) v1(40.79,83.78) v1(40.79,78.7) v1(40.79,73.62) v1(40.79,68.54) v1(40.79,63.46) v1(40.79,58.38) v1(40.79,53.3) v1(40.79,48.22) v1(40.79,43.14) v1(43.65,27.07) v1(44.57,29.65) v1(44.81,73.37) v1(44.81,68.41) v1(44.81,67.02) v1(45.87,99.02) v1(45.87,93.94) v1(45.87,83.78) v1(45.87,78.7) v1(45.87,63.46) v1(45.87,53.3) v1(45.87,48.22) v1(45.87,43.14) v1(45.87,32.98) v1(45.87,27.9) v1(47.53,24.54) v1(47.58,23.39) v1(47.79,85.4) v1(47.79,81.4) v1(47.79,78.4) v1(47.79,74.4) v1(47.79,67.9) v1(48.06,42.04) v1(48.06,40.78) v1(48.46,23.92) v1(49.07,42.63) v1(49.07,39.84) v1(49.36,24.5) v1(49.45,84.67) v1(49.4,23.4) v1(49.58,81.94) v1(49.96,65.94) v1(50.36,42.63) v1(50.95,99.02) v1(50.95,88.86) v1(50.95,78.7) v1(50.95,73.62) v1(50.95,68.54) v1(50.95,48.22) v1(50.95,43.14) v1(50.95,32.98) v1(50.95,27.9) v1(50.98,81.94) v1(51.04,39.62) v1(51.64,42.63) v1(51.93,93.43) v1(51.93,29.6) v1(52.5,39.61) v1(52.94,52.41) v1(52.93,42.63) v1(53.09,27.09) v1(53.26,49.43) v1(53.45,50.51) v1(53.5,44.6) v1(53.5,43.34) v1(53.96,54.82) v1(54.15,94.77) v1(54.53,39.59) v1(54.71,49.35) v1(54.97,64.22) v1(55.67,39.26) v1(55.93,42.44) v1(56.03,88.86) v1(56.03,83.78) v1(56.03,78.7) v1(56.03,73.62) v1(56.03,43.14) v1(56.12,62.57) v1(56.12,47.84) v1(56.25,46.44) v1(57.07,41.3) v1(58.4,41.23) v1(59.74,53.62) v1(59.82,38.25) v1(60.37,94.89) v1(60.62,91.73) v1(61.11,83.78) v1(61.11,78.7) v1(61.11,73.62) v1(61.11,68.54) v1(61.11,58.38) v1(61.52,57.68) v1(61.52,53.49) v1(61.64,40.92) v1(62.57,54.81) v1(62.99,35.94) v1(63.12,62.57) v1(63.36,93.43) v1(63.77,54.81) v1(63.8,57.74) v1(64.17,37.11) v1(64.57,54.81) v1(64.76,41.36) v1(64.95,57.3) v1(64.95,38.25) v1(65.01,53.3) v1(65.62,91.73) v1(66.09,56.67) v1(66.19,93.94) v1(66.19,83.78) v1(66.19,68.54) v1(66.97,54.32) v1(67.36,56.67) v1(68.18,43.14) v1(68.44,50.54) v1(68.5,53.63) v1(68.63,47.4) v1(69.11,27.1) v1(70.03,56.25) v1(70.03,46.55) v1(70.09,29.66) v1(71.11,39.96) v1(71.26,51.9) v1(71.23,50.12) v1(71.27,32.98) v1(71.27,27.9) v1(71.36,45.43) v1(71.34,42.15) v1(71.43,44.15) v1(71.62,91.73) v1(72.12,62.57) v1(72.71,24.62) v1(72.8,23.44) v1(73.64,24.01) v1(74.54,24.59) v1(74.58,23.49) v1(75.04,60.79) v1(76.35,93.94) v1(76.35,48.22) v1(76.35,32.98) v1(76.35,27.9) v1(76.95,89.4) v1(76.95,83.9) v1(76.95,76.4) v1(76.95,70.9) v1(77.16,29.64) v1(78.19,27.05) v1(78.47,90.89) v1(78.53,73.18) v1(78.53,65.17) v1(78.66,87.02) v1(78.66,82.83) v1(78.66,75.21) v1(80.06,73.18) v1(80.06,65.17) v1(80.44,87.02) v1(80.44,82.83) v1(81.43,93.94) v1(81.43,88.86) v1(81.43,73.62) v1(81.43,68.54) v1(81.43,63.46) v1(81.43,48.22) v1(86.51,99.02) v1(86.51,93.94) v1(86.51,88.86) v1(86.51,73.62) v1(86.51,53.3) v1(86.51,48.22) v1(86.51,38.06) v1(91.59,99.02) v1(91.59,93.94) v1(91.59,88.86) v1(91.59,78.7) v1(91.59,68.54) v1(91.59,58.38) v1(91.59,48.22) v1(91.59,38.06) v1(94.64,27.08) v1(95.61,29.67) v1(96.06,59.3) v1(96.67,99.02) v1(96.67,93.94) v1(96.67,88.86) v1(96.67,83.78) v1(96.67,78.7) v1(96.67,73.62) v1(96.67,68.54) v1(96.67,63.46) v1(96.67,53.3) v1(96.67,48.22) v1(96.67,38.06) v1(96.67,32.98) v1(96.67,27.9) v1(101.75,99.02) v1(101.75,93.94) v1(101.75,88.86) v1(101.75,83.78) v1(101.75,78.7) v1(101.75,73.62) v1(101.75,68.54) v1(101.75,63.46) v1(101.75,48.22) v1(101.75,32.98) v1(101.75,27.9) v1(102.55,29.63) v1(103.41,27.09) v1(106.83,99.02) v1(106.83,93.94) v1(106.83,88.86) v1(106.83,83.78) v1(106.83,78.7) v1(106.83,73.62) v1(106.83,68.54) v1(106.83,63.46) v1(106.83,48.22) v1(106.83,43.14) v1(111.91,99.02) v1(111.91,93.94) v1(111.91,88.86) v1(111.91,83.78) v1(111.91,78.7) v1(111.91,73.62) v1(111.91,68.54) v1(111.91,63.46) v1(111.91,53.3) v1(111.91,48.22) v1(111.91,43.14) v1(111.91,38.06) v1(116.99,99.02) v1(116.99,93.94) v1(116.99,88.86) v1(116.99,83.78) v1(116.99,78.7) v1(116.99,73.62) v1(116.99,68.54) v1(116.99,63.46) v1(116.99,58.38) v1(116.99,53.3) v1(116.99,48.22) v1(116.99,43.14) v1(116.99,38.06) v1(119.94,27.09) v1(120.84,29.64) v2(46.84,61.94) v2(49.32,60.91) v2(49.32,57.11) v2(50.21,52.41) v2(51.36,53.93) v2(51.99,66.76) v2(55.55,84.41) v2(57.33,95.84) v2(57.33,52.92) v2(62.53,66.38) v2(67.36,64.6) v2(69.52,58.76) v2(70.66,66.13) v2(70.91,89.88) v2(71.68,58.63) v2(72.18,47.08) v2(72.62,65.45) v2(73.84,93.05) v2(74.85,89.11) v2(78.53,78.83) v2(78.53,77.68) v2(79.93,77.18) v2(81.46,77.18) v2(81.96,82.26) v2(83.11,77.18) v2(83.23,81.87) v2(83.23,80.48) v2(83.23,78.83)
VDD: length 4.8
  Top Layer w0.305: U12.6 20.96,73.89 20.73,73.67 20.73,73.07 20.91,72.89 U12.8 21.26,72.71 21.26,72.47 ; 21.26,71.51 21.26,72.47 ; 21.26,72.47 20.11,72.47
BOOT_BTN: length 46.5
  Top Layer w0.254: U2.197 69.62,61.78 69.94,61.45 70.73,61.45 74.44,57.74 v2(74.44,56.6) ; R20.2 88.31,50 v2(86.28,50)
  Top Layer w0.508: R20.2 96.1,57.71 U3.4 U3.3
  Bottom Layer w0.254: v2(74.44,56.6) 81.05,50 v2(86.28,50)
CC1: length 5.2
  Top Layer w0.203: USB1.4 6.25,82.49 5.38,81.62 v1(5.38,81.27)
  Bottom Layer w0.203: v1(5.38,81.27) 5.04,81.61 4.38,81.61 4.23,81.76 U10.1
CC2: length 5.1
  Top Layer w0.203: USB1.10 6.24,79.49 5.38,80.35 v1(5.38,80.71)
  Bottom Layer w0.203: U11.1 4.1,80.33 4.38,80.61 4.53,80.61 4.63,80.71 v1(5.38,80.71)
CHASSIS_GND:
  vias: v1(3.99,14.4) v1(3.99,10.59) v1(7.8,14.4) v1(7.8,10.59) v1(11.61,14.4) v1(11.61,10.59) v1(15.42,14.4) v1(15.42,10.59) v1(19.23,14.4) v1(19.23,10.59) v1(23.04,14.4) v1(23.04,10.59) v1(26.85,14.4) v1(26.85,10.59) v1(30.66,14.4) v1(30.66,10.59) v1(34.47,14.4) v1(34.47,10.59) v1(38.28,14.4) v1(38.28,10.59) v1(42.09,14.4) v1(42.09,10.59) v1(45.9,14.4) v1(45.9,10.59) v1(47.51,20.21) v1(47.56,19.07) v1(48.44,19.6) v1(49.34,20.18) v1(49.38,19.08) v1(49.71,14.4) v1(49.71,10.59) v1(53.52,14.4) v1(53.52,10.59) v1(57.33,14.4) v1(57.33,10.59) v1(61.14,14.4) v1(61.14,10.59) v1(64.95,14.4) v1(64.95,10.59) v1(68.76,14.4) v1(68.76,10.59) v1(72.57,14.4) v1(72.57,10.59) v1(72.78,20.33) v1(72.78,19.19) v1(73.66,19.72) v1(74.56,20.3) v1(74.59,19.2) v1(76.38,14.4) v1(76.38,10.59) v1(80.19,14.4) v1(80.19,10.59) v1(84,14.4) v1(84,10.59) v1(87.81,14.4) v1(87.81,10.59) v1(91.62,14.4) v1(91.62,10.59) v1(95.43,14.4) v1(95.43,10.59) v1(99.24,14.4) v1(99.24,10.59) v1(103.05,14.4) v1(103.05,10.59) v1(106.86,14.4) v1(106.86,10.59) v1(110.67,14.4) v1(110.67,10.59) v1(114.48,14.4) v1(114.48,10.59) v1(118.29,14.4) v1(118.29,10.59)
D+: length 48.3
  Top Layer w0.203: 8.2,80.83 8.2,81.38 8.09,81.49 USB1.6 ; 8.2,80.83 8.2,80.63 8.05,80.48 7.13,80.48 USB1.8 ; 8.2,80.83 v1(8.68,80.83) ; v1(45.64,69.48) 46.01,69.48 46.11,69.58 46.29,69.58 46.41,69.47 46.72,69.47 46.79,69.4 U2.146
  Bottom Layer w0.203: v1(8.68,80.83) 9.81,80.83 9.84,80.86 10.71,80.86 D3.1 11.36,80.22 13.64,80.22 14.6,81.19 27.15,81.19 38.76,69.58 45.17,69.58 45.28,69.48 v1(45.64,69.48)
D-: length 49
  Top Layer w0.203: v1(45.64,70.04) 46.01,70.04 46.11,69.94 46.44,69.94 46.56,69.82 46.72,69.82 46.79,69.9 U2.145 ; v1(8.56,82.02) 8.53,81.99 USB1.5 6.4,81.99 6.14,81.74 6.14,81.11 6.27,80.99 USB1.7
  Bottom Layer w0.203: v1(8.56,82.02) 9.94,82.02 10.09,81.87 D3.2 11.23,82.38 13.76,82.38 14.6,81.54 27.3,81.54 38.91,69.94 45.17,69.94 45.28,70.04 v1(45.64,70.04)
IND1.2: length 0.8
  Top Layer w0.305: U12.18 27.23,73.39
IND2.5: length 0.8
  Top Layer w0.305: U12.23 27.23,75.89
P2_1: length 29.7
  Top Layer w0.104: U1.1 56.17,38.68 56.25,38.6 56.25,38.56 55.95,38.27 39.87,38.27 32.65,31.05 32.65,30.34 31.94,29.63 RJ45_1.11
P2_2: length 11.6
  Top Layer w0.104: RJ45_2.11 56.98,29.73 57.15,29.9 57.25,29.8 60.65,33.2 60.65,38.6 60.57,38.68 U1.12
P2_3: length 23.9
  Top Layer w0.104: RJ45_3.11 81.41,30.6 79.67,30.6 79.31,30.96 79.2,30.96 79.05,30.8 78.94,30.8 78.69,31.05 78.69,31.16 78.84,31.32 78.84,31.42 78.59,31.67 78.49,31.67 78.33,31.52 78.22,31.52 77.97,31.77 77.97,31.88 78.13,32.03 78.13,32.14 77.87,32.39 77.77,32.39 77.61,32.23 77.5,32.23 77.25,32.49 77.25,32.59 77.41,32.75 77.41,32.86 74.6,35.66 67.37,35.66 65.45,37.59 65.45,38.6 65.37,38.68 U1.24
P2_4: length 45.3
  Top Layer w0.104: RJ45_4.11 107.76,29.65 107.76,30.81 106.82,31.76 106.82,32.61 104.97,34.45 104.87,34.45 104.79,34.37 104.68,34.37 104.43,34.63 104.43,34.73 104.51,34.81 104.51,34.92 104.25,35.17 104.15,35.17 104.07,35.09 103.96,35.09 103.71,35.34 103.71,35.45 103.79,35.53 103.79,35.64 103.54,35.89 103.43,35.89 103.35,35.81 103.24,35.81 102.99,36.06 102.99,36.17 103.07,36.25 103.07,36.35 102.82,36.61 102.71,36.61 102.63,36.53 102.53,36.53 102.27,36.78 102.27,36.88 102.35,36.97 102.35,37.07 98,41.42 70.91,41.42 70.83,41.35 U1.34
P2_5: length 56.3
  Top Layer w0.104: RJ45_5.11 6.64,29.63 7.46,30.45 7.46,31.27 23.45,47.27 53.83,47.27 53.9,47.35 U1.112
P3_1: length 29.7
  Top Layer w0.104: U1.2 56.57,38.68 56.49,38.6 56.49,38.46 56.05,38.02 39.97,38.02 35.19,33.25 35.19,33.07 34.92,32.8 34.74,32.8 34.47,32.53 34.47,32.35 34.2,32.08 34.02,32.08 33.75,31.81 33.75,31.63 33.48,31.36 33.3,31.36 32.89,30.95 32.89,30.34 RJ45_1.10
P3_2: length 11.6
  Top Layer w0.104: 58.43,29.8 58.12,30.12 58.12,30.33 58.85,31.06 58.96,31.06 59.02,31 59.13,31 59.38,31.25 59.38,31.36 59.32,31.42 59.32,31.53 59.57,31.78 59.68,31.78 59.74,31.72 59.84,31.72 60.1,31.97 60.1,32.08 60.04,32.14 60.04,32.25 60.89,33.1 60.89,38.6 60.97,38.68 U1.13
P3_3: length 23.9
  Top Layer w0.104: U1.25 65.77,38.68 65.69,38.6 65.69,37.69 67.47,35.91 74.7,35.91 79.77,30.84 83.2,30.84 RJ45_3.10
P3_4: length 45.3
  Top Layer w0.104: U1.35 70.83,41.75 70.91,41.67 98.1,41.67 107.06,32.71 107.06,31.86 109.29,29.63 RJ45_4.10
P3_5: length 56.3
  Top Layer w0.104: RJ45_5.10 7.7,30.14 7.7,31.17 8.05,31.52 8.15,31.52 8.19,31.47 8.3,31.47 8.55,31.73 8.55,31.83 8.51,31.87 8.51,31.98 8.76,32.23 8.87,32.23 8.91,32.19 9.02,32.19 9.27,32.45 9.27,32.55 9.23,32.59 9.23,32.7 9.48,32.95 9.59,32.95 9.63,32.91 9.73,32.91 9.99,33.16 9.99,33.27 9.95,33.31 9.95,33.42 10.2,33.67 10.3,33.67 10.35,33.63 10.45,33.63 10.71,33.88 10.71,33.99 10.66,34.03 10.66,34.13 23.55,47.02 53.83,47.02 53.9,46.95 U1.113
P4_1: length 35.1
  Top Layer w0.104: U1.4 57.37,38.68 57.45,38.6 57.45,38.56 56.42,37.54 40.18,37.54 35.68,33.04 35.68,31.34 35.6,31.27 35.04,31.27 34.97,31.2 34.97,30.84 35.04,30.76 35.6,30.76 35.68,30.69 35.68,30.33 35.6,30.25 35.04,30.25 34.97,30.18 34.97,29.82 35.04,29.75 35.6,29.75 35.68,29.67 35.68,29.31 35.6,29.24 35.04,29.24 34.97,29.17 34.97,28.8 35.04,28.73 35.6,28.73 35.68,28.66 35.68,28.14 RJ45_1.4
P4_2: length 19.2
  Top Layer w0.104: U1.15 61.77,38.68 61.85,38.6 61.85,31.07 58.84,28.06 57.59,28.06 57.02,27.49 57.02,26.69 57.59,26.12 59.05,26.12 RJ45_2.4
P4_3: length 34.9
  Top Layer w0.104: 85.39,26.94 84.53,26.07 82.97,26.07 82.42,26.63 82.42,27.51 82.98,28.07 83.77,28.07 83.98,27.86 84.43,27.86 85.69,29.12 85.69,31.88 84.11,33.46 77.84,33.46 74.9,36.39 67.68,36.39 66.25,37.82 66.25,38.6 66.17,38.68 U1.26
P4_4: length 55.9
  Top Layer w0.104: RJ45_4.4 110.79,27.12 110.79,27.12 109.79,26.12 108.39,26.12 107.82,26.69 107.82,27.49 108.39,28.06 109.99,28.06 110.84,28.91 110.84,31.12 99.34,42.62 70.91,42.62 70.83,42.55 U1.37
P4_5: length 59.5
  Top Layer w0.104: U1.115 53.9,46.15 53.83,46.07 23.95,46.07 14.24,36.36 14.13,36.36 14.06,36.43 13.96,36.43 13.7,36.17 13.7,36.07 13.77,36 13.77,35.89 13.52,35.64 13.41,35.64 13.34,35.71 13.24,35.71 12.98,35.46 12.98,35.35 13.05,35.28 13.05,35.17 12.8,34.92 12.7,34.92 12.62,34.99 12.52,34.99 12.26,34.74 12.26,34.63 12.34,34.56 12.34,34.46 12.08,34.2 11.98,34.2 11.9,34.27 11.8,34.27 11.55,34.02 11.55,33.91 11.62,33.84 11.62,33.74 11.36,33.48 11.26,33.48 11.19,33.56 11.08,33.56 10.83,33.3 10.83,33.2 10.9,33.12 10.9,33.02 10.64,32.76 10.54,32.76 10.47,32.84 10.36,32.84 10.11,32.58 10.11,32.48 10.18,32.41 10.18,32.3 9.73,31.85 9.73,30.99 9.66,30.91 9.45,30.91 9.38,30.84 9.38,30.48 9.45,30.41 9.66,30.41 9.73,30.33 9.73,29.97 9.66,29.9 9.45,29.9 9.38,29.82 9.38,29.46 9.45,29.39 9.66,29.39 9.73,29.32 9.73,28.95 9.66,28.88 9.45,28.88 9.38,28.81 9.38,28.45 9.45,28.37 9.66,28.37 9.73,28.3 9.73,27.79 9.2,27.26 9.2,27.11 RJ45_5.4
P5_1: length 31.9
  Top Layer w0.104: U1.6 58.17,38.68 58.25,38.6 58.25,38.21 56.85,36.81 40.53,36.81 36.44,32.72 36.44,29.11 37.44,28.12 37.44,27.66 36.87,27.09 RJ45_1.3
P5_2: length 15.6
  Top Layer w0.104: v6(63.39,36.33) 63.22,36.5 63.22,36.72 63.08,36.85 63.08,37.37 62.65,37.81 62.65,38.6 62.57,38.68 U1.17
  Bottom Layer w0.104: RJ45_2.3 62.05,28.2 61.46,28.8 61.46,31.28 61.85,31.67 61.85,31.77 61.77,31.85 61.77,31.96 62.02,32.21 62.13,32.21 62.21,32.13 62.31,32.13 62.56,32.39 62.56,32.49 62.49,32.57 62.49,32.67 62.74,32.93 62.84,32.93 62.92,32.85 63.03,32.85 63.28,33.1 63.28,33.21 63.2,33.29 63.2,33.39 63.46,33.65 63.56,33.65 63.64,33.57 63.75,33.57 64.16,33.98 64.16,35.77 63.78,36.15 63.56,36.15 v6(63.39,36.33)
P5_3: length 29.5
  Top Layer w0.104: U1.28 66.97,38.68 67.05,38.6 67.05,38.14 68.04,37.14 81.65,37.14 86.84,31.95 86.84,29.41 88.19,28.06 88.19,27.82 RJ45_3.3
P5_4: length 53.3
  Top Layer w0.104: U1.39 70.83,43.35 70.91,43.42 100.71,43.42 111.99,32.14 111.99,31.86 111.92,31.78 111.78,31.78 111.71,31.71 111.71,31.35 111.78,31.28 111.92,31.28 111.99,31.2 111.99,29.55 112.68,28.86 112.68,28.76 112.62,28.7 112.62,28.59 112.87,28.34 112.98,28.34 113.04,28.4 113.14,28.4 113.52,28.02 113.52,27.76 RJ45_4.3
P5_5: length 55.1
  Top Layer w0.104: RJ45_5.3 11.58,27.41 11.58,27.91 10.73,28.76 10.73,29.27 10.65,29.35 10.62,29.35 10.55,29.42 10.55,29.78 10.62,29.85 10.65,29.85 10.73,29.93 10.73,30.29 10.65,30.36 10.62,30.36 10.55,30.44 10.55,30.8 10.62,30.87 10.65,30.87 10.73,30.94 10.73,31.79 24.21,45.27 53.83,45.27 53.9,45.35 U1.117
P6_1: length 31.8
  Top Layer w0.104: RJ45_1.2 38.68,27.22 36.68,29.21 36.68,32.62 40.63,36.57 56.95,36.57 58.49,38.11 58.49,38.6 58.57,38.68 U1.7
P6_2: length 15.6
  Top Layer w0.104: v6(63.78,36.72) 63.61,36.89 63.39,36.89 63.33,36.95 63.33,37.47 62.89,37.91 62.89,38.6 62.97,38.68 U1.18
  Bottom Layer w0.104: v6(63.78,36.72) 63.95,36.54 63.95,36.33 64.4,35.88 64.4,33.88 61.71,31.18 61.71,28.9 63.51,27.09 RJ45_2.2
P6_3: length 29.6
  Top Layer w0.104: U1.29 67.37,38.68 67.29,38.6 67.29,38.25 68.15,37.39 81.75,37.39 87.08,32.05 87.08,29.51 89.48,27.11 RJ45_3.2
P6_4: length 53.3
  Top Layer w0.104: U1.40 70.83,43.75 70.91,43.67 100.81,43.67 112.24,32.24 112.24,29.65 114.52,27.36 114.71,27.36 114.88,27.19 RJ45_4.2
P6_5: length 55.2
  Top Layer w0.104: U1.118 53.9,44.95 53.83,45.02 24.31,45.02 10.97,31.69 10.97,28.86 12.75,27.09 RJ45_5.2
P7_1: length 35.1
  Top Layer w0.104: U1.5 57.77,38.68 57.69,38.6 57.69,38.46 56.52,37.29 40.28,37.29 35.92,32.94 35.92,27.82 35.59,27.49 35.59,26.69 35.03,26.12 33.56,26.12 RJ45_1.5
P7_2: length 19.2
  Top Layer w0.104: RJ45_2.5 58.21,27.09 59.21,28.08 59.31,28.08 59.41,27.98 59.52,27.98 59.77,28.24 59.77,28.34 59.67,28.44 59.67,28.55 59.93,28.8 60.03,28.8 60.13,28.7 60.23,28.7 60.49,28.96 60.49,29.06 60.39,29.16 60.39,29.27 60.64,29.52 60.75,29.52 60.85,29.42 60.95,29.42 61.21,29.68 61.21,29.78 61.11,29.88 61.11,29.98 61.36,30.24 61.47,30.24 61.57,30.14 61.67,30.14 61.93,30.39 61.93,30.5 61.83,30.6 61.83,30.7 62.09,30.97 62.09,31.48 62.16,31.55 62.51,31.55 62.59,31.63 62.59,31.99 62.51,32.06 62.16,32.06 62.09,32.13 62.09,32.5 62.16,32.57 62.51,32.57 62.59,32.64 62.59,33 62.51,33.08 62.16,33.08 62.09,33.15 62.09,33.51 62.16,33.58 62.51,33.58 62.59,33.66 62.59,34.02 62.51,34.09 62.16,34.09 62.09,34.17 62.09,34.53 62.16,34.6 62.51,34.6 62.59,34.67 62.59,35.04 62.51,35.11 62.16,35.11 62.09,35.18 62.09,38.6 62.17,38.68 U1.16
P7_3: length 29.8
  Top Layer w0.104: RJ45_3.5 84,27.09 85.93,29.02 85.93,31.98 84.21,33.7 77.94,33.7 75,36.64 67.78,36.64 66.49,37.92 66.49,38.6 66.57,38.68 U1.27
P7_4: length 55.8
  Top Layer w0.104: U1.38 70.83,42.95 70.91,42.87 99.44,42.87 105.95,36.36 106.06,36.36 106.2,36.5 106.3,36.5 106.56,36.24 106.56,36.14 106.41,36 106.41,35.89 106.67,35.64 106.77,35.64 106.92,35.78 107.02,35.78 107.27,35.52 107.27,35.42 107.13,35.28 107.13,35.17 107.39,34.92 107.49,34.92 107.63,35.06 107.74,35.06 107.99,34.81 107.99,34.7 107.85,34.56 107.85,34.46 108.11,34.2 108.21,34.2 108.35,34.34 108.46,34.34 108.71,34.09 108.71,33.98 108.57,33.84 108.57,33.74 108.82,33.48 108.93,33.48 109.07,33.62 109.17,33.62 109.43,33.37 109.43,33.27 109.29,33.12 109.29,33.02 109.54,32.76 109.65,32.76 109.79,32.91 109.89,32.91 110.15,32.65 110.15,32.55 110.01,32.4 110.01,32.3 110.26,32.05 110.37,32.05 110.51,32.19 110.61,32.19 110.87,31.93 110.87,31.83 110.72,31.69 110.72,31.58 111.09,31.22 111.09,31.11 111.16,31.03 111.31,31.03 111.38,30.96 111.38,30.6 111.31,30.53 111.16,30.53 111.09,30.45 111.09,30.09 111.16,30.02 111.31,30.02 111.38,29.94 111.38,29.58 111.31,29.51 111.16,29.51 111.09,29.44 111.09,28.81 109.37,27.09 RJ45_4.5
P7_5: length 59.4
  Top Layer w0.104: RJ45_5.5 7.19,26.99 7.37,26.82 8.13,26.82 8.82,26.12 9.63,26.12 10.19,26.69 10.19,27.49 9.98,27.71 9.98,31.75 24.05,45.82 53.83,45.82 53.9,45.75 U1.116
P8_1: length 34.1
  Top Layer w0.104: 39.72,29.77 39.69,29.8 39.69,30.5 39.43,30.77 37.98,30.77 37.31,31.44 37.31,32.55 39.88,35.13 39.89,35.13 40.29,35.54 41.89,35.54 41.96,35.61 41.96,35.79 42.03,35.87 42.39,35.87 42.47,35.79 42.47,35.61 42.54,35.54 42.9,35.54 42.97,35.61 42.97,35.79 43.05,35.87 43.41,35.87 43.48,35.79 43.48,35.61 43.56,35.54 43.92,35.54 43.99,35.61 43.99,35.79 44.06,35.87 44.43,35.87 44.5,35.79 44.5,35.61 44.57,35.54 44.93,35.54 45.01,35.61 45.01,35.79 45.08,35.87 45.44,35.87 45.51,35.79 45.51,35.61 45.59,35.54 45.95,35.54 46.02,35.61 46.02,35.79 46.1,35.87 46.46,35.87 46.53,35.79 46.53,35.61 46.6,35.54 46.97,35.54 47.04,35.61 47.04,35.79 47.11,35.87 47.47,35.87 47.55,35.79 47.55,35.61 47.62,35.54 47.98,35.54 48.06,35.61 48.06,35.79 48.13,35.87 48.49,35.87 48.56,35.79 48.56,35.61 48.64,35.54 49,35.54 49.07,35.61 49.07,35.79 49.14,35.87 49.51,35.87 49.58,35.79 49.58,35.61 49.65,35.54 56.6,35.54 59.05,37.98 59.05,38.6 58.97,38.68 U1.8
P8_2: length 14.8
  Top Layer w0.104: RJ45_2.8 65.15,29.63 65.78,30.26 65.78,30.88 65.7,30.95 65.53,30.95 65.46,31.03 65.46,31.39 65.53,31.46 65.7,31.46 65.78,31.53 65.78,33.13 65.7,33.21 65.21,33.21 65.13,33.28 65.13,33.64 65.21,33.71 65.7,33.71 65.78,33.79 65.78,34.15 65.7,34.22 65.21,34.22 65.13,34.3 65.13,34.66 65.21,34.73 65.7,34.73 65.78,34.8 65.78,35.16 65.7,35.24 65.21,35.24 65.13,35.31 65.13,35.67 65.21,35.75 65.7,35.75 65.78,35.82 65.78,36.23 63.85,38.16 63.85,38.6 63.77,38.68 U1.20
P8_3: length 26.6
  Top Layer w0.104: 90.16,29.74 90.08,29.74 81.74,38.09 68.62,38.09 68.25,38.46 68.25,38.6 68.17,38.68 U1.31
P8_4: length 57.4
  Top Layer w0.104: 115.43,30.01 115.43,30.13 115.08,30.48 114.97,30.48 114.92,30.43 114.82,30.43 114.57,30.69 114.57,30.79 114.62,30.84 114.62,30.95 114.08,31.48 114.08,31.91 113.66,32.33 113.56,32.33 113.41,32.18 113.31,32.18 113.05,32.44 113.05,32.54 113.2,32.69 113.2,32.79 112.94,33.05 112.84,33.05 112.69,32.9 112.59,32.9 112.33,33.16 112.33,33.26 112.48,33.41 112.48,33.51 112.22,33.77 112.12,33.77 111.97,33.62 111.87,33.62 111.61,33.88 111.61,33.98 111.76,34.13 111.76,34.23 111.5,34.48 111.4,34.48 111.25,34.34 111.15,34.34 110.9,34.59 110.9,34.7 111.04,34.84 111.04,34.95 110.79,35.2 110.68,35.2 110.54,35.06 110.43,35.06 110.18,35.31 110.18,35.42 110.32,35.56 110.32,35.67 110.07,35.92 109.96,35.92 109.82,35.78 109.71,35.78 109.46,36.03 109.46,36.13 109.6,36.28 109.6,36.38 109.35,36.64 109.25,36.64 109.1,36.49 109,36.49 108.74,36.75 108.74,36.85 108.89,37 108.89,37.1 108.63,37.36 108.53,37.36 108.38,37.21 108.28,37.21 108.02,37.47 108.02,37.57 108.17,37.72 108.17,37.82 107.91,38.08 107.81,38.08 107.66,37.93 107.56,37.93 107.3,38.19 107.3,38.29 107.45,38.44 107.45,38.54 107.19,38.8 107.09,38.8 106.94,38.65 106.84,38.65 106.59,38.9 106.59,39.01 106.73,39.15 106.73,39.26 101.37,44.62 70.91,44.62 70.83,44.55 U1.42
P8_5: length 49.8
  Top Layer w0.104: RJ45_5.8 14.3,29.63 15.59,30.93 16.79,30.93 17.65,31.79 17.65,31.89 17.52,32.02 17.52,32.12 17.78,32.38 17.88,32.38 18.01,32.25 18.11,32.25 18.37,32.51 18.37,32.61 18.24,32.74 18.24,32.84 18.5,33.1 18.6,33.1 18.73,32.97 18.83,32.97 19.09,33.22 19.09,33.33 18.96,33.46 18.96,33.56 19.22,33.81 19.32,33.81 19.45,33.69 19.55,33.69 19.81,33.94 19.81,34.05 19.68,34.17 19.68,34.28 19.94,34.53 20.04,34.53 20.17,34.41 20.27,34.41 20.53,34.66 20.53,34.77 20.4,34.89 20.4,35 20.65,35.25 20.76,35.25 20.88,35.12 20.99,35.12 21.24,35.38 21.24,35.48 21.12,35.61 21.12,35.71 21.37,35.97 21.48,35.97 21.6,35.84 21.71,35.84 21.96,36.1 21.96,36.2 21.84,36.33 21.84,36.43 22.09,36.69 22.19,36.69 22.32,36.56 22.43,36.56 29.93,44.07 53.83,44.07 53.9,44.15 U1.120
P9_1: length 34
  Top Layer w0.104: 38.22,29.27 38.28,29.2 38.75,29.2 39.3,28.66 40.1,28.66 40.67,29.23 40.67,30.03 40.1,30.6 39.96,30.6 39.55,31.01 38.08,31.01 37.55,31.54 37.55,32.45 39.98,34.88 39.99,34.88 40.39,35.29 56.7,35.29 59.29,37.88 59.29,38.6 59.37,38.68 U1.9
P9_2: length 14.8
  Top Layer w0.104: U1.21 64.17,38.68 64.09,38.6 64.09,38.26 66.02,36.33 66.02,30.08 66.07,30.03 66.07,29.23 65.5,28.66 64.68,28.66 63.98,29.36 63.24,29.36 63.07,29.53 RJ45_2.9
P9_3: length 31.8
  Top Layer w0.104: 88.63,29.66 89.09,29.66 90.1,28.66 90.9,28.66 91.47,29.23 91.47,30.03 90.89,30.61 89.56,30.61 81.84,38.33 68.72,38.33 68.49,38.56 68.49,38.6 68.57,38.68 U1.32
P9_4: length 57.5
  Top Layer w0.104: U1.43 70.83,44.95 70.91,44.87 101.47,44.87 114.33,32.01 114.33,31.58 115.26,30.64 116.26,30.64 116.87,30.03 116.87,29.23 116.3,28.66 115.5,28.66 115.07,29.08 114.74,29.08 114.14,29.68
P9_5: length 49.8
  Top Layer w0.104: RJ45_5.9 13.24,28.66 14.7,28.66 15.27,29.23 15.27,30.26 15.69,30.68 16.89,30.68 30.03,43.82 53.83,43.82 53.9,43.75 U1.121
